# Altium schematic sheet w5100-Module sheld.SchDoc
size A; PageSetup: Record=PageOptions|CenterHorizontal=True|CenterVertical=True|PrintScale=1.00|XCorrection=1.00|YCorrection=1.00|PrintKind=1|BorderSize=5000000|LeftOffset=0|BottomOffset=0|Orientation=2|PaperLength=1000|PaperWidth=1000|Scale=100|PaperSource=7|PrintQuality=-3|MediaType=1|DitherType=10|PrintScaleMode=1|PaperKind=A4|PaperIndex=9
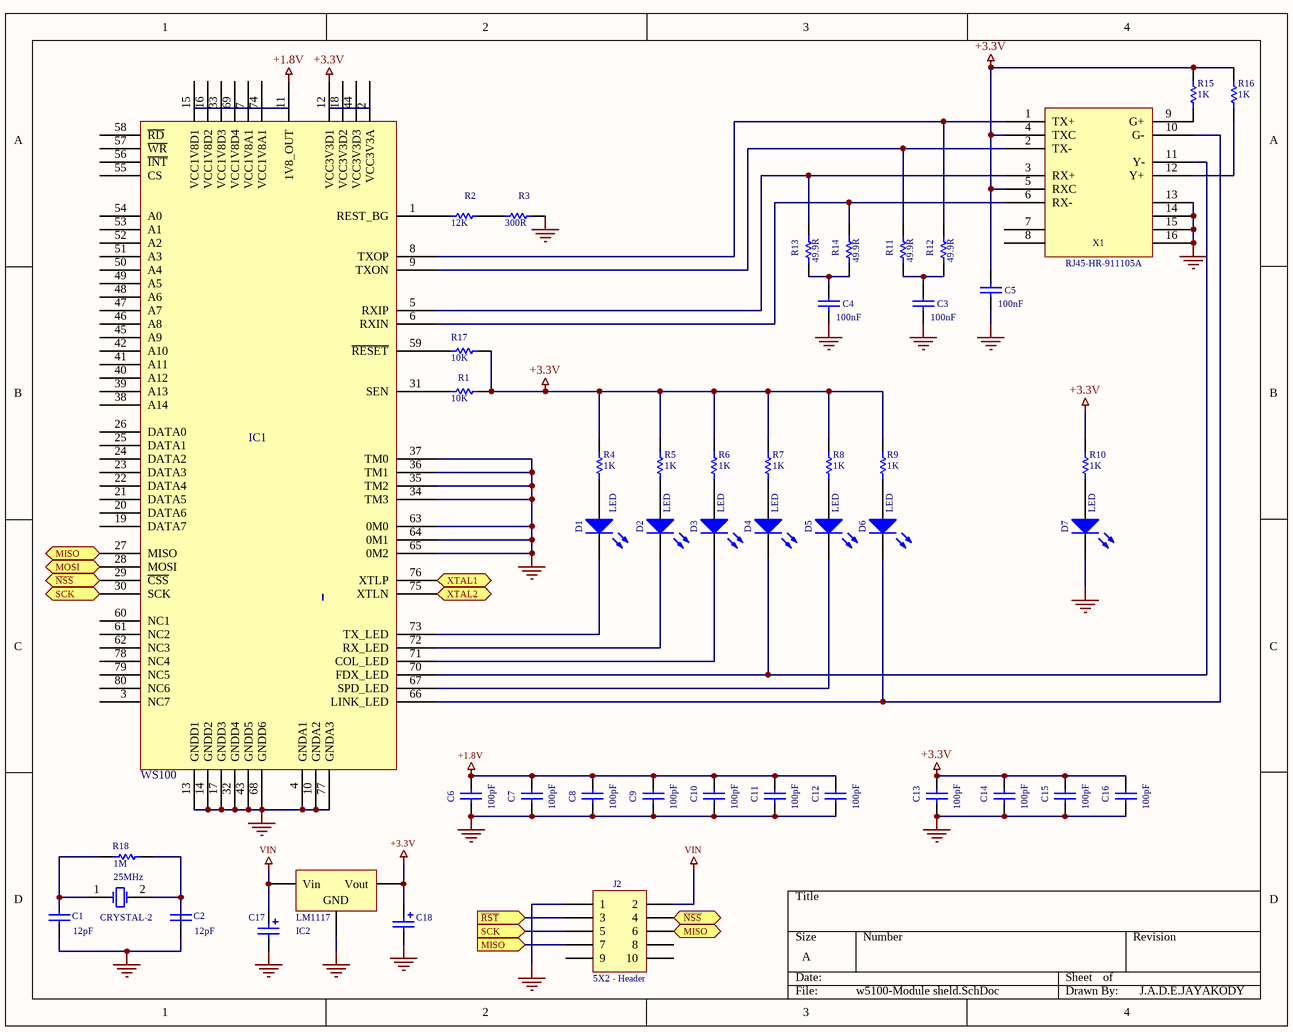
[diagram p0: w5100-Module sheld.SchDoc]

## Parts
25MHz  CRYSTAL-2  [R38]
C1  value 12pF  [RAD-0.3]  (hidden comment: Cap)
C2  value 12pF  [RAD-0.3]  (hidden comment: Cap)
C3  value 100nF  [RAD-0.3]  (hidden comment: Cap)
C4  value 100nF  [RAD-0.3]  (hidden comment: Cap)
C5  value 100nF  [RAD-0.3]  (hidden comment: Cap)
C6  value 100pF  [RAD-0.3]  (hidden comment: Cap)
C7  value 100pF  [RAD-0.3]  (hidden comment: Cap)
C8  value 100pF  [RAD-0.3]  (hidden comment: Cap)
C9  value 100pF  [RAD-0.3]  (hidden comment: Cap)
C10  value 100pF  [RAD-0.3]  (hidden comment: Cap)
C11  value 100pF  [RAD-0.3]  (hidden comment: Cap)
C12  value 100pF  [RAD-0.3]  (hidden comment: Cap)
C13  value 100pF  [RAD-0.3]  (hidden comment: Cap)
C14  value 100pF  [RAD-0.3]  (hidden comment: Cap)
C15  value 100pF  [RAD-0.3]  (hidden comment: Cap)
C16  value 100pF  [RAD-0.3]  (hidden comment: Cap)
C17  Cap Pol2  [POLAR0.8]  (value not drawn)
C18  Cap Pol2  [POLAR0.8]  (value not drawn)
D1  LED  [LED-0]
D2  LED  [LED-0]
D3  LED  [LED-0]
D4  LED  [LED-0]
D5  LED  [LED-0]
D6  LED  [LED-0]
D7  LED  [LED-0]
IC1  WS100
J2  5X2 - Header  [HDR2X5H]
LM1117  IC2  [D2PAK_N]
R1  value 10K  [AXIAL-0.3]  (hidden comment: Res1)
R2  value 12K  [AXIAL-0.3]  (hidden comment: Res1)
R3  value 300R  [AXIAL-0.3]  (hidden comment: Res1)
R4  value 1K  [AXIAL-0.3]  (hidden comment: Res1)
R5  value 1K  [AXIAL-0.3]  (hidden comment: Res1)
R6  value 1K  [AXIAL-0.3]  (hidden comment: Res1)
R7  value 1K  [AXIAL-0.3]  (hidden comment: Res1)
R8  value 1K  [AXIAL-0.3]  (hidden comment: Res1)
R9  value 1K  [AXIAL-0.3]  (hidden comment: Res1)
R10  value 1K  [AXIAL-0.3]  (hidden comment: Res1)
R11  value 49.9R  [AXIAL-0.3]  (hidden comment: Res1)
R12  value 49.9R  [AXIAL-0.3]  (hidden comment: Res1)
R13  value 49.9R  [AXIAL-0.3]  (hidden comment: Res1)
R14  value 49.9R  [AXIAL-0.3]  (hidden comment: Res1)
R15  value 1K  [AXIAL-0.3]  (hidden comment: Res1)
R16  value 1K  [AXIAL-0.3]  (hidden comment: Res1)
R17  value 10K  [AXIAL-0.3]  (hidden comment: Res1)
R18  value 1M  [AXIAL-0.3]  (hidden comment: Res1)
X1  RJ45-HR-911105A

## Ports
MISO (in), MOSI (in), SCK (in), XTAL1 (in), XTAL2 (in), ~{NSS} (in), ~{RST} (in)

## Nets
+1.8V: C6.2 C7.2 C8.2 C9.2 C10.2 C11.2 C12.2 IC1.11(1V8_OUT)
+3.3V: C5.2 C13.2 C14.2 C15.2 C16.2 C18.1 IC1.12(VCC3V3D1) LM1117.3(Vout) R1.2 R4.2 R5.2 R6.2 R7.2 R8.2 R9.2 R10.2 R15.2 R16.2 R17.2 X1.4(TXC) X1.5(RXC)
NetC1_1: C1.1 C2.1 C3.1 C4.1 C5.1 C6.1 C7.1 C8.1 C9.1 C10.1 C11.1 C12.1 C13.1 C14.1 C15.1 C16.1 C17.2 C18.2 D7.2(K) IC1.4(GNDA1) IC1.10(GNDA2) IC1.13(GNDD1) IC1.14(GNDD2) IC1.17(GNDD3) IC1.32(GNDD4) IC1.34(TM3) IC1.35(TM2) IC1.36(TM1) IC1.37(TM0) IC1.43(GNDD5) IC1.63(0M0) IC1.64(0M1) IC1.65(0M2) IC1.68(GNDD6) IC1.77(GNDA3) J2.1 LM1117.2(GND) R3.2 X1.13 X1.14 X1.15 X1.16
VIN: C17.1 J2.2 LM1117.1(Vin)
MISO: IC1.27(MISO) J2.6 J2.7 ; port MISO
MOSI: IC1.28(MOSI) ; port MOSI
~{NSS}: IC1.29(~{CSS}) J2.4 ; port ~{NSS}
~{RST}: J2.3 ; port ~{RST}
SCK: IC1.30(SCK) J2.5 ; port SCK
XTAL1: IC1.76(XTLP) ; port XTAL1
XTAL2: IC1.75(XTLN) ; port XTAL2
Net25MHz_1: 25MHz.1(OSC1) C1.2 R18.1
Net25MHz_2: 25MHz.2(OSC2) C2.2 R18.2
NetC3_2: C3.2 R11.1 R12.1
NetC4_2: C4.2 R13.1 R14.1
NetD1_1: D1.1(A) R4.1
NetD1_2: D1.2(K) IC1.73(TX_LED)
NetD2_1: D2.1(A) R5.1
NetD2_2: D2.2(K) IC1.72(RX_LED)
NetD3_1: D3.1(A) R6.1
NetD3_2: D3.2(K) IC1.71(COL_LED)
NetD4_1: D4.1(A) R7.1
NetD4_2: D4.2(K) IC1.70(FDX_LED) X1.11(Y-)
NetD5_1: D5.1(A) R8.1
NetD5_2: D5.2(K) IC1.67(SPD_LED)
NetD6_1: D6.1(A) R9.1
NetD6_2: D6.2(K) IC1.66(LINK_LED) X1.10(G-)
NetD7_1: D7.1(A) R10.1
NetIC1_1: IC1.1(REST_BG) R2.1
NetIC1_5: IC1.5(RXIP) R13.2 X1.3(RX+)
NetIC1_6: IC1.6(RXIN) R14.2 X1.6(RX-)
NetIC1_8: IC1.8(TXOP) R12.2 X1.1(TX+)
NetIC1_9: IC1.9(TXON) R11.2 X1.2(TX-)
NetIC1_31: IC1.31(SEN) R1.1
NetIC1_59: IC1.59(~{RESET}) R17.1
NetR2_2: R2.2 R3.1
NetR15_1: R15.1 X1.9(G+)
NetR16_1: R16.1 X1.12(Y+)

Not connected (* = marked no-connect by the designer): IC1 2(VCC3V3A) 3(NC7) 7(VCC1V8A1) 15(VCC1V8D1) 16(VCC1V8D2) 18(VCC3V3D2) 19(DATA7) 20(DATA6) 21(DATA5) 22(DATA4) 23(DATA3) 24(DATA2) 25(DATA1) 26(DATA0) 33(VCC1V8D3) 38(A14) 39(A13) 40(A12) 41(A11) 42(A10) 44(VCC3V3D3) 45(A9) 46(A8) 47(A7) 48(A6) 49(A5) 50(A4) 51(A3) 52(A2) 53(A1) 54(A0) 55(CS) 56(~{INT}) 57(~{WR}) 58(~{RD}) 60(NC1) 61(NC2) 62(NC3) 69(VCC1V8D4) 74(VCC1V8A1) 78(NC4) 79(NC5) 80(NC6); J2 8 9 10; X1 7 8

## Notes on the sheet
- J.A.D.E.JAYAKODY

## Library data of the parts
25MHz = XTAL: Crystal Oscillator; Published: 8-Jun-2000; LatestRevisionDate: 17-Jul-2002; LatestRevisionNote: Re-released for DXP Platform.; PackageReference: R38; Publisher: Altium Limited; PackageDescription: Crystal, Thru-Hole; 2 Leads; Body 3.1 x 8.2 mm (Dia.xH)
C1-C16 = Cap: Capacitor; Published: 8-Jun-2000; LatestRevisionDate: 17-Jul-2002; LatestRevisionNote: Re-released for DXP Platform.; PackageReference: RAD-0.3; Publisher: Altium Limited; PackageDescription: Radial Cap, Thru-Hole; 2 Leads; 0.3 in Pin Spacing
C17 C18 = Cap Pol2: Polarized Capacitor (Axial); Value: 100pF; Published: 8-Jun-2000; LatestRevisionDate: 17-Jul-2002; LatestRevisionNote: Re-released for DXP Platform.; PackageReference: POLAR0.8; Publisher: Altium Limited; PackageDescription: Polarized Capacitor; 2 Leads
D1-D7 = LED0: Typical INFRARED GaAs LED; Published: 8-Jun-2000; LatestRevisionDate: 08-Jul-2005; LatestRevisionNote: Mech Layer 1 removed.; PackageReference: LED-0; Publisher: Altium Limited; PackageDescription: LED; 2 Leads
IC1 X1 = Component_1
J2 = Header 5X2H: Header, 5-Pin, Dual row, Right Angle; LatestRevisionDate: 17-Jul-2002; LatestRevisionNote: Re-released for DXP Platform.; Publisher: Altium Limited
LM1117 = Volt Reg: Voltage Regulator; Published: 24-Mar-1999; LatestRevisionDate: 29-May-2009; LatestRevisionNote: IPC-7351 Footprint Added.; PackageReference: D2PAK; Publisher: Altium Limited; PackageDescription: 3-Pin Transistor Outline Package 2.54 mm Pitch, 15.1 mm Lead Span
R1-R18 = Res1: Resistor; Published: 8-Jun-2000; LatestRevisionDate: 17-Jul-2002; LatestRevisionNote: Re-released for DXP Platform.; PackageReference: AXIAL-0.3; Publisher: Altium Limited; PackageDescription: Axial Device, Thru-Hole; 2 Leads; 0.3 in Pin Spacing